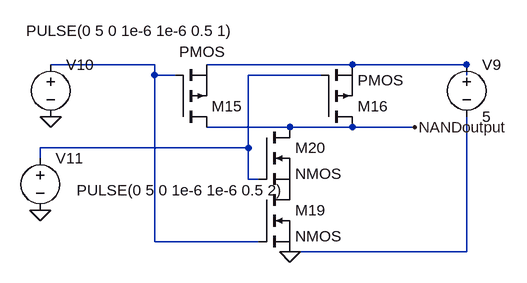
[diagram p0: schematic nand.asc]
nand.asc, the LTspice schematic file:
Version 4
SHEET 1 2860 680
WIRE 2096 -1152 1936 -1152
WIRE 2400 -1152 2176 -1152
WIRE 2576 -1152 2400 -1152
WIRE 2096 -1136 2096 -1152
WIRE 2128 -1136 2096 -1136
WIRE 2352 -1136 2240 -1136
WIRE 2576 -1136 2576 -1152
WIRE 2304 -1056 2176 -1056
WIRE 2400 -1056 2304 -1056
WIRE 2496 -1056 2400 -1056
WIRE 2240 -1024 2240 -1136
WIRE 2240 -1024 1920 -1024
WIRE 1920 -1008 1920 -1024
WIRE 2240 -976 2240 -1024
WIRE 2256 -976 2240 -976
WIRE 2096 -880 2096 -1136
WIRE 2256 -880 2096 -880
WIRE 2576 -864 2576 -1072
WIRE 2576 -864 2304 -864
FLAG 2496 -1056 NANDoutput
FLAG 2304 -864 0
FLAG 1920 -928 0
FLAG 1936 -1072 0
SYMBOL pmos 2128 -1056 M180
WINDOW 3 6 116 Left 2
SYMATTR InstName M15
SYMBOL pmos 2352 -1056 M180
SYMATTR InstName M16
SYMBOL voltage 2576 -1168 R0
WINDOW 123 0 0 Left 2
WINDOW 39 0 0 Left 2
SYMATTR InstName V9
SYMATTR Value 5
SYMBOL nmos 2256 -960 R0
SYMATTR InstName M19
SYMBOL nmos 2256 -1056 R0
SYMATTR InstName M20
SYMBOL voltage 1936 -1168 R0
WINDOW 123 0 0 Left 2
WINDOW 39 0 0 Left 2
WINDOW 3 -38 -36 Left 2
SYMATTR Value PULSE(0 5 0 1e-6 1e-6 0.5 1)
SYMATTR InstName V10
SYMBOL voltage 1920 -1024 R0
WINDOW 123 0 0 Left 2
WINDOW 39 0 0 Left 2
WINDOW 3 56 65 Left 2
SYMATTR Value PULSE(0 5 0 1e-6 1e-6 0.5 2)
SYMATTR InstName V11

The netlist it stands for:
* nand.asc
M15 NANDoutput N001 N002 N002 PMOS
M16 NANDoutput N003 N002 N002 PMOS
V9 N002 0 5
M19 P001 N001 0 0 NMOS
M20 NANDoutput N003 P001 P001 NMOS
V10 N001 0 PULSE(0 5 0 1e-6 1e-6 0.5 1)
V11 N003 0 PULSE(0 5 0 1e-6 1e-6 0.5 2)
.model NMOS NMOS
.model PMOS PMOS
.lib standard.mos
.backanno
.end